# EAGLE design expansion_module_dual_potentiometer (EAGLE 9.6.2)
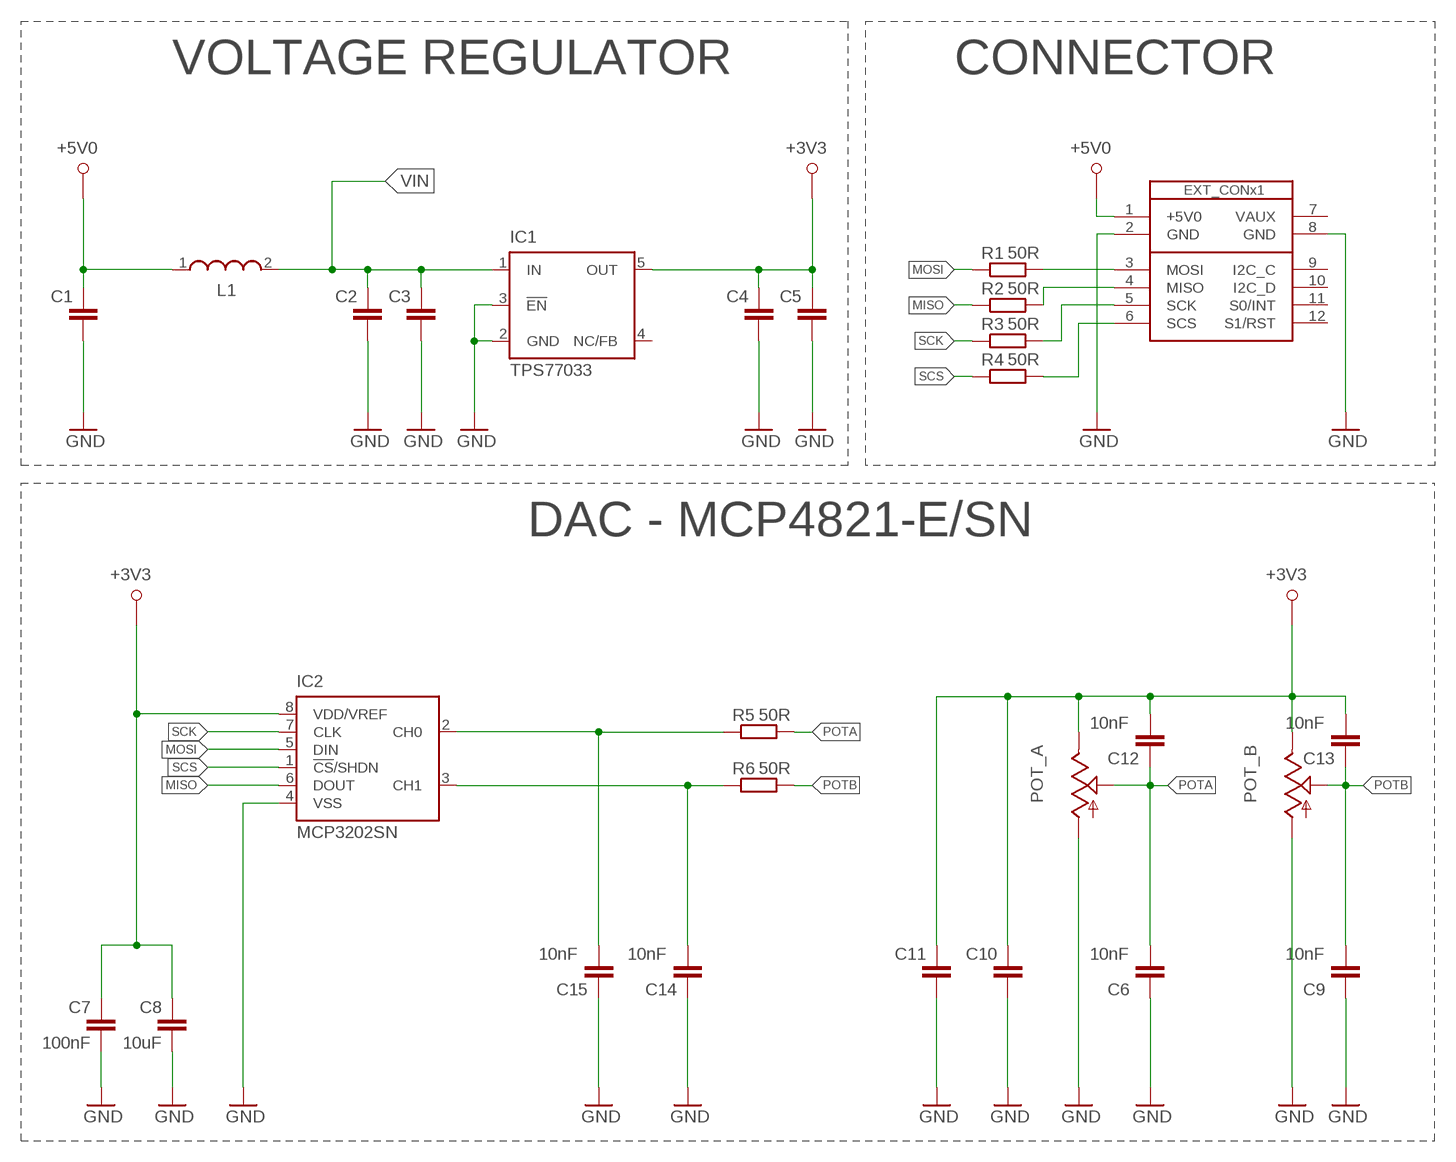
[diagram p0: schematic, sheet 1]

## Parts
C1  C-EUC0805  [C0805]
C2  C-EUC0805  [C0805]
C3  C-EUC0805  [C0805]
C4  C-EUC0805  [C0805]
C5  C-EUC0805  [C0805]
C6  10nF  C-EUC0805  [C0805]
C7  100nF  C-EUC0805  [C0805]
C8  10uF  C-EUC0805  [C0805]
C9  10nF  C-EUC0805  [C0805]
C10  C-EUC0805  [C0805]
C11  C-EUC0805  [C0805]
C12  10nF  C-EUC0805  [C0805]
C13  10nF  C-EUC0805  [C0805]
C14  10nF  C-EUC0805  [C0805]
C15  10nF  C-EUC0805  [C0805]
IC1  TPS77033  [SOT23-DBV]
IC2  MCP3202SN  [SO-08]
L1  WE-LQ_1210  [WE-LQ_M]
POT_A  9MM_SNAP-IN_POT_  [9MM_SNAP-IN_POT]
POT_B  9MM_SNAP-IN_POT_  [9MM_SNAP-IN_POT]
R1  50R  R-EU_R0805  [R0805]
R2  50R  R-EU_R0805  [R0805]
R3  50R  R-EU_R0805  [R0805]
R4  50R  R-EU_R0805  [R0805]
R5  50R  R-EU_R0805  [R0805]
R6  50R  R-EU_R0805  [R0805]
U$1  SB_EXT_CON_X1_SPI  [SB_EXT_CON_X1_FULL]

## Nets
+3V3: C4.2 C5.2 C7.2 C8.2 C10.2 C11.2 C12.1 C13.1 IC1.5(OUT) IC2.8(VDD/VREF) POT_A.3(E) POT_B.3(E)
+5V0: C1.2 L1.1 U$1.1(+5V0)
GND: C1.1 C2.1 C3.1 C4.1 C5.1 C6.2 C7.1 C8.1 C9.2 C10.1 C11.1 C14.2 C15.2 IC1.2(GND) IC1.3(!EN) IC2.4(VSS) POT_A.1(A) POT_B.1(A) U$1.2(GND) U$1.8(GND)
MISO: IC2.6(DOUT) R2.1
MOSI: IC2.5(DIN) R1.1
N$1: R1.2 U$1.3(MOSI)
N$3: R3.2 U$1.5(SCK)
N$4: R4.2 U$1.6(SCS)
N$6: R2.2 U$1.4(MISO)
N$8: C14.1 IC2.3(CH1) R6.1
N$11: C15.1 IC2.2(CH0) R5.1
POTA: C6.1 C12.2 POT_A.2(S) R5.2
POTB: C9.1 C13.2 POT_B.2(S) R6.2
SCK: IC2.7(CLK) R3.1
SCS: IC2.1(!CS!/SHDN) R4.1
VIN: C2.2 C3.2 IC1.1(IN) L1.2
Unconnected: IC1.4(NC/FB) U$1.7(VAUX) U$1.9(I2C_C) U$1.10(I2C_D) U$1.11(S0/INT) U$1.12(S1/RST)

## Notes on the sheet
- VOLTAGE REGULATOR | CONNECTOR
- DAC - MCP4821-E/SN

## Library data of the parts
C1-C15 = resistor:C-EU: CAPACITOR, European symbol
IC1 = texas:TPS770*: ULTRALOW-POWER 50-mA LOW-DROPOUT LINEAR REGULATORS 50-mA Low-Dropout Regulator Source: http://focus.ti.com/lit/ds/symlink/tps77001.pdf; MF: TEXAS INSTRUMENTS; MPN: TPS77033DBVT; OC_FARNELL: 8461570; OC_NEWARK: 77C1187
IC2 = microchip:MCP3202: 2.7V Dual Channel 12-Bit A/D Converter with SPI Serial Interface Source: http://ww1.microchip.com/downloads/en/DeviceDoc/21034D.pdf; MF: MICROCHIP; MPN: MCP3202-CI/SN; OC_FARNELL: 1196803; OC_NEWARK: 19C7207
L1 = EagleLibrary_Wuerth_Elektronik_eiSos_rev16a:WE-LQ: SMD Inductor Characteristics Miniature chip inductor wound on a special ferrite core Small inductances for compact circuits High Q at high frequencies Low DC-resistance Operating temperature: –40 ºC to +125 ºC Applications Low power DC/DC-converters from Linear Technology, National Semiconductor, Texas Instruments, Fairchild Semiconductor, ON Semiconductor, STMicroelectronics, Maxim, MPS, Semtech, Exar, Analogic Tech, Diodes and Cologne Chip EMI-Filtering RF-circuits <http://katalog.we-online.de/media/images/eisos/IndLQ_pf2.jpg> Details see: http://katalog.we-online.de/en/pbs/WE-LQ? Updated by Dan Xu 2014-07-08 2014 (C) Wurth Elektronik
POT_A POT_B = MusicThingModular:9MM_SNAP-IN_POT: 9mm vertical snap-in pot, Alpha / Panasonic style
R1-R6 = resistor:R-EU_: RESISTOR, European symbol
U$1 = al_smartboard:SB_EXT_CON_X1_SPI

## Net classes
0 default: clearance 0.205 mm

## Board
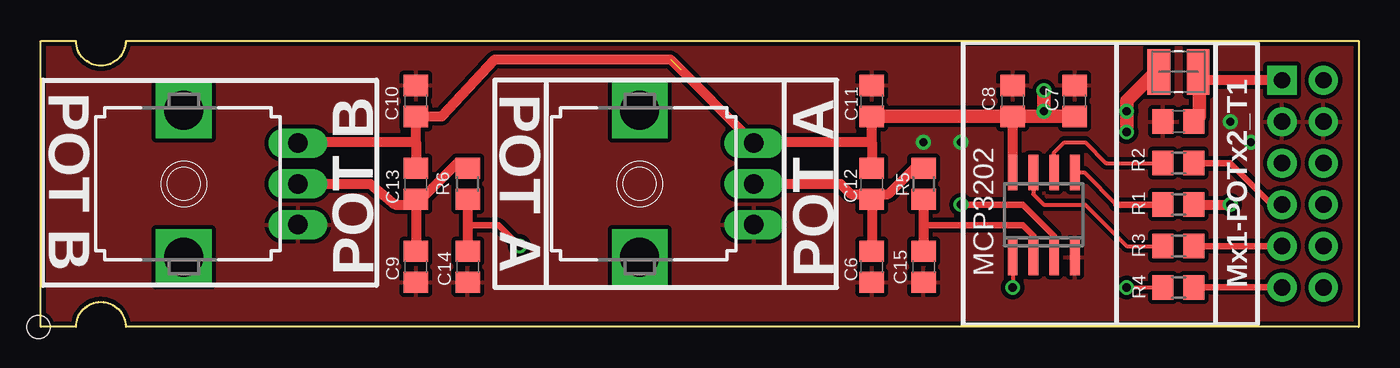
[diagram p1: board, top side]
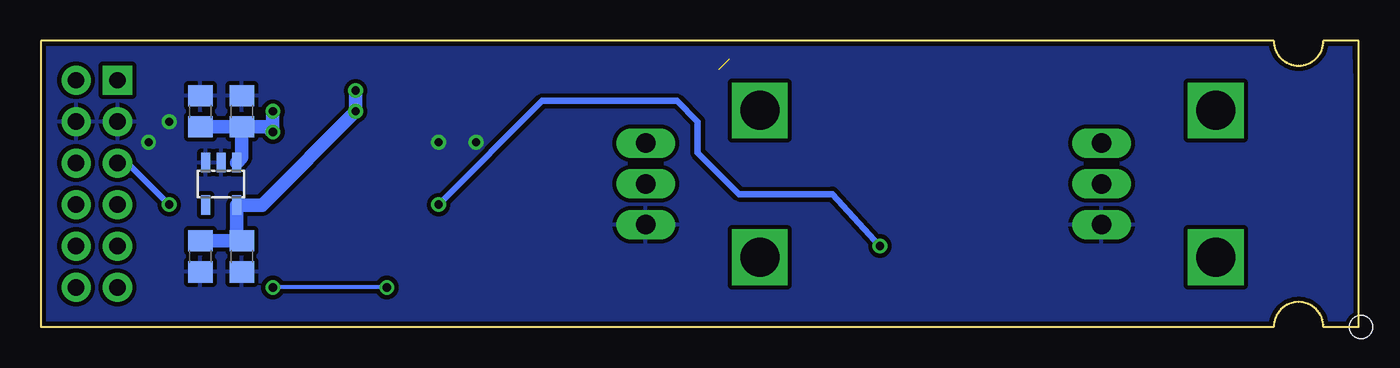
[diagram p2: board, bottom side, seen from below]

Size 80.77 x 17.53 mm. Coordinates in mm from the lower left corner, seen from the top.
Copper layers (1*16): Top 0.035mm / dielectric 1.5mm / Bottom 0.035mm
Design rules "default *": minimum track width 10mil, minimum drill 24mil, track to track 8mil, track to pad 8mil, pad to pad 8mil, via to via 8mil, smd to smd 8mil, copper to edge 10mil, drill to drill 20mil, minimum pad ring 10mil, minimum via ring 8mil, stop-mask expansion 4mil, vias tented up to drill 30mil, thermal gap 10mil
Holes 1.4 mm at -0.13,0

### Footprints (pad centres in the part's own frame; a part is rotated, then mirrored left to right if it is on the bottom)
C0805 = smd 1.3 x 1.5: 1 -0.95,0; 2 0.95,0
SOT23-DBV = smd 0.55 x 1.2: 1 -0.95,-1.3; 2 0,-1.3; 3 0.95,-1.3; 4 0.95,1.3; 5 -0.95,1.3
SO-08 = smd 0.6 x 2.2: 1 -1.905,-2.6; 2 -0.635,-2.6; 3 0.635,-2.6; 4 1.905,-2.6; 5 1.905,2.6; 6 0.635,2.6; 7 -0.635,2.6; 8 -1.905,2.6
WE-LQ_M = smd 1.4 x 2.8: 1 -1.2,0; 2 1.2,0
9MM_SNAP-IN_POT = drill 1.2 long: 1 -2.5,-7; 2 0,-7; 3 2.5,-7 | drill 2.4 square: CHASSIS1 -4.5,0; CHASSIS2 4.5,0
R0805 = smd 1.3 x 1.5: 1 -0.95,0; 2 0.95,0
SB_EXT_CON_X1_FULL = drill 1 pad 1.778 square: 1 15.24,5.08 | drill 1 pad 1.778: 2 12.7,5.08; 3 10.16,5.08; 4 7.62,5.08; 5 5.08,5.08; 6 2.54,5.08; 7 15.24,2.54; 8 12.7,2.54; 9 10.16,2.54; 10 7.62,2.54; 11 5.08,2.54; 12 2.54,2.54

### Placement (x,y rotation side)
C1  69.72,12.57 0 top
C2  68.45,13.21 270 bottom
C3  70.99,13.21 270 bottom
C4  68.45,4.32 90 bottom
C5  70.99,4.32 90 bottom
C6  50.93,3.68 270 top
C7  63.37,13.84 270 top
C8  59.56,13.84 270 top
C9  22.99,3.68 270 top
C10  22.99,13.84 270 top
C11  50.93,13.84 270 top
C12  50.93,8.76 270 top
C13  22.99,8.76 270 top
C14  26.16,3.68 270 top
C15  54.1,3.68 270 top
IC1  69.72,8.76 180 bottom
IC2  61.47,6.86 0 top
L1  69.72,15.62 180 top
POT_A  36.7,8.76 90 top
POT_B  8.76,8.76 90 top
R1  69.72,7.49 0 top
R2  69.72,10.03 0 top
R3  69.72,4.95 0 top
R4  69.72,2.41 0 top
R5  54.1,8.76 90 top
R6  26.16,8.76 90 top
U$1  81.15,-0.13 90 top

### Tracks (layer width: path | path; a pad name or v marks a point on that pad's centre or on a via)
+3V3  (via drill 0.5)  (1 unrouted)
  Top 0.61: IC2.8 C8.2 54.74,12.89 | C10.2 22.99,12.57 | 22.99,11.3 15.8,11.3 POT_B.3 | 50.93,12.57 C11.2 50.93,11.3 | 50.93,11.3 43.74,11.3 POT_A.3 38.58,16.38 27.81,16.38 24.58,12.89 C10.2 | 39.24,15.75 39.24,15.72 | 22.99,11.3 C10.2 | 22.99,11.3 C13.1 | 50.93,11.3 C12.1
  Top 0.813: v61.47,14.48 v61.47,13.21 61.78,12.89 C7.2 C8.2 C11.2
  Bottom 0.813: C5.2 C4.2 68.77,5.59 IC1.5 67.21,7.46 v61.47,13.21 v61.47,14.48
+5V0
  Top 0.61: 70.99,14.48 70.99,15.11 | 70.99,15.11 70.99,15.55 L1.1 | U$1.1 70.99,15.11
  Top 0.813: 70.99,14.48 70.99,12.89 C1.2
GND  (via drill 0.5)
  other vias: 72.9,12.57 74.17,11.3 54.1,11.3 56.39,11.3
  pour Top (isolate 0.254): 82.14,17.65 -0.79,17.65 -0.76,-0.13 82.19,-0.13
  pour Bottom (isolate 0.254): 81.66,17.65 81.03,-0.13 -0.13,-0.13 0.51,17.65
MISO
  Top 0.254: IC2.6 62.1,10.67 62.74,11.3 64.01,11.3 65.28,10.03 R2.1
MOSI
  Top 0.254: IC2.5 63.95,9.46 65.91,7.49
  Top 0.406: 65.91,7.49 R1.1
N$1  (via drill 0.5)
  Top 0.61: R1.2 v72.9,7.49
  Bottom 0.406: U$1.3 75.44,10.03 v72.9,7.49
N$3
  Top 0.406: U$1.5 R3.2
N$4
  Top 0.406: U$1.6 R4.2
N$6
  Top 0.406: R2.2 72.9,10.03 75.44,7.49 U$1.4
N$8  (via drill 0.5)
  Top 0.406: IC2.3 62.1,5.59 60.2,7.49 v56.39,7.49 | v29.34,4.95 28.07,6.22 26.16,6.22
  Top 0.61: R6.1 26.16,6.22 C14.1
  Bottom 0.406: v56.39,7.49 50.04,13.84 41.78,13.84 40.51,12.57 40.51,10.67 37.97,8.13 32.26,8.13 v29.34,4.95
N$11
  Top 0.406: IC2.2 60.83,5.59 60.2,6.22 54.1,6.22
  Top 0.61: R5.1 54.1,6.22 C15.1
POTA
  Top 0.61: C12.2 50.61,8.13 49.66,8.13 49.02,8.76 POT_A.2 | C12.2 51.25,7.81 51.56,8.13 51.94,8.13 53.59,9.78 54.04,9.78 R5.2 | C12.2 C6.1
POTB
  Top 0.61: C13.2 C9.1 | C13.2 23.31,7.81 25.53,10.03 25.84,10.03 R6.2 | POT_B.2 20.19,8.76 21.72,7.49 22.67,7.49 C13.2
SCK
  Top 0.254: IC2.7 60.83,8.13 61.47,7.49 64.01,7.49 66.55,4.95 R3.1
  Top 0.406: 68.52,5.21 R3.1
SCS  (via drill 0.5)
  Top 0.254: IC2.1 v59.56,2.41 | v66.55,2.41 R4.1
  Bottom 0.254: v59.56,2.41 v66.55,2.41
VIN  (via drill 0.5)
  Top 0.813: L1.2 68.45,15.62 68.45,15.75 66.55,13.84 v66.55,13.21 v66.55,11.94
  Bottom 0.813: C3.2 C2.2 | C2.2 68.45,10.38 IC1.1 | C2.2 66.87,12.26 v66.55,11.94 v66.55,13.21

### Text on the board
tPlace: POT B | POT A | Mx1-POTx2_T1 | POT B | POT A
tNames: MCP3202